# Altium schematic sheet STM32405RG.SchDoc: MCU STM
size A4; Author: Jennifer, Gaston, Alfonso; Organization: Waterloop; Address1: 200 University Ave W; Address2: Engineering 5, 1104; Address3: Waterloo, ON; Address4: N2L 3G1; DocumentNumber: 3; SheetNumber: 3; SheetTotal: 5
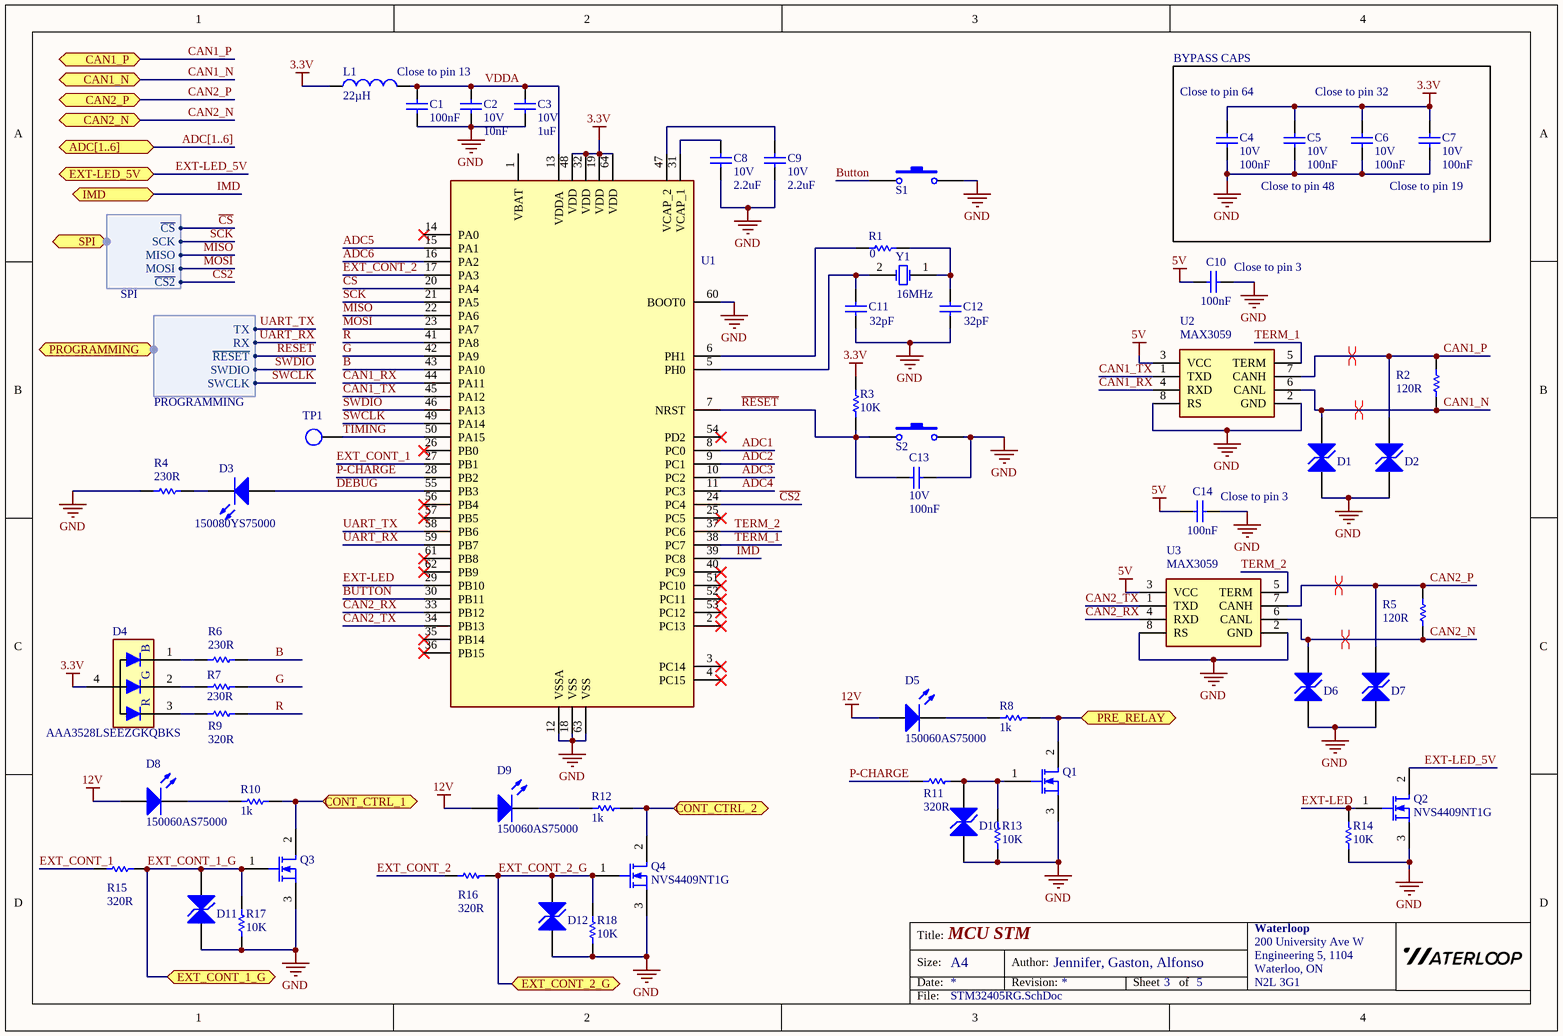
[diagram p0: STM32405RG.SchDoc]

## Parts
C1  value 100nF  [0805 - Capacitor]  (hidden comment: Capacitor - Nonpolarized)
C2  10V  value 10nF  [0805 - Capacitor]
C3  10V  value 1uF  [0805 - Capacitor]
C4  10V  value 100nF  [0805 - Capacitor]
C5  10V  value 100nF  [0805 - Capacitor]
C6  10V  value 100nF  [0805 - Capacitor]
C7  10V  value 100nF  [0805 - Capacitor]
C8  10V  value 2.2uF  [0805 - Capacitor]
C9  10V  value 2.2uF  [0805 - Capacitor]
C10  value 100nF  [0805 - Capacitor]  (hidden comment: 10V)
C11  value 32pF  [0805 - Capacitor]  (hidden comment: 50V)
C12  value 32pF  [0805 - Capacitor]  (hidden comment: 50V)
C13  10V  value 100nF  [0805 - Capacitor]
C14  value 100nF  [0805 - Capacitor]  (hidden comment: 10V)
D1  TVS  [SOD323 - DIODE]  (value not drawn)
D2  TVS  [SOD323 - DIODE]  (value not drawn)
D3  150080YS75000  [0805 - Resistor]
D4  AAA3528LSEEZGKQBKS  [4-PLCC RGB LED]
D5  150060AS75000  [0603 - Resistor]
D6  TVS  [SOD323 - DIODE]  (value not drawn)
D7  TVS  [SOD323 - DIODE]  (value not drawn)
D8  150060AS75000  [0603 - Resistor]
D9  150060AS75000  [0603 - Resistor]
D10  TVS  [SOD323 - DIODE]  (value not drawn)
D11  TVS  [SOD323 - DIODE]  (value not drawn)
D12  TVS  [SOD323 - DIODE]  (value not drawn)
L1  value 22µH  [0805 - Capacitor]  (hidden comment: Inductor)
Q1  NVS4409NT1G  [SC70/SOT323]  (value not drawn)
Q2  NVS4409NT1G  [SC70/SOT323]
Q3  NVS4409NT1G  [SC70/SOT323]  (value not drawn)
Q4  NVS4409NT1G  [SC70/SOT323]
R1  value 0  [0603 - Resistor]  (hidden comment: 0603)
R2  value 120R  [0603 - Resistor]  (hidden comment: 1%)
R3  value 10K  [0603 - Resistor]  (hidden comment: 5%)
R4  value 230R  [0603 - Resistor]  (hidden comment: 1%)
R5  value 120R  [0603 - Resistor]  (hidden comment: 1%)
R6  value 230R  [0603 - Resistor]  (hidden comment: 1%)
R7  value 230R  [0603 - Resistor]  (hidden comment: 1%)
R8  value 1k  [0603 - Resistor]  (hidden comment: 5%)
R9  value 320R  [0603 - Resistor]  (hidden comment: 1%)
R10  value 1k  [0603 - Resistor]  (hidden comment: 5%)
R11  value 320R  [0603 - Resistor]  (hidden comment: 1%)
R12  value 1k  [0603 - Resistor]  (hidden comment: 5%)
R13  value 10K  [0603 - Resistor]  (hidden comment: 5%)
R14  value 10K  [0603 - Resistor]  (hidden comment: 5%)
R15  value 320R  [0603 - Resistor]  (hidden comment: 1%)
R16  value 320R  [0603 - Resistor]  (hidden comment: 1%)
R17  value 10K  [0603 - Resistor]  (hidden comment: 5%)
R18  value 10K  [0603 - Resistor]  (hidden comment: 5%)
S1  PTS636 SM43 SMTR LFS  [6x6mm Switch]  (value not drawn)
S2  PTS636 SM43 SMTR LFS  [6x6mm Switch]  (value not drawn)
TP1  (no value)  [Test Point - 5002]  (no BOM)
U1  (no value)  [STM32F405RG]
U2  MAX3059  [MAX3059]
U3  MAX3059  [MAX3059]
Y1  value 16MHz  [2-SMD NO LEAD CRSYSTAL]  (hidden comment: ABM3-16.000MHZ-B2-T)

## Ports
ADC[1..6] (bidir), CAN1_N (bidir), CAN1_P (bidir), CAN2_N (bidir), CAN2_P (bidir), CONT_CTRL_1 (bidir), CONT_CTRL_2 (bidir), EXT-LED_5V (bidir), EXT_CONT_1_G (bidir), EXT_CONT_2_G (bidir), IMD (bidir), PRE_RELAY (bidir), PROGRAMMING (bidir, harness PROGRAMMING), SPI (bidir, harness SPI)

## Harnesses
SPI: ~{CS}, SCK, MISO, MOSI, ~{CS2}
PROGRAMMING: SWCLK, SWDIO, ~{RESET}, TX, RX

## Nets
3.3V: C4.1 C5.1 C6.1 C7.1 D4.4 L1.1 R3.2 U1.19(VDD) U1.32(VDD) U1.48(VDD) U1.64(VDD)
5V: C10.2 C14.2 U2.3(VCC) U3.3(VCC)
12V: D5.1(A) D8.1(A) D9.1(A)
GND: C1.1 C2.1 C3.2 C4.2 C5.2 C6.2 C7.2 C8.1 C9.1 C10.1 C11.1 C12.1 C13.2 C14.1 D1.1(A) D2.1(A) D6.1(A) D7.1(A) D10.1(A) D11.1(A) D12.1(A) Q1.3(S) Q2.3(S) Q3.3(S) Q4.3(S) R4.2 R13.1 R14.1 R17.1 R18.1 S1.2 S2.2 U1.12(VSSA) U1.18(VSS) U1.60(BOOT0) U1.63(VSS) U2.2(GND) U2.8(RS) U3.2(GND) U3.8(RS)
~{RESET}: C13.1 R3.1 S2.1 U1.7(NRST) ; port PROGRAMMING.~{RESET}
ADC1: U1.8(PC0)
ADC2: U1.9(PC1)
ADC3: U1.10(PC2)
ADC4: U1.11(PC3)
ADC5: U1.15(PA1)
ADC6: U1.16(PA2)
B: R6.1 U1.43(PA10)
Button: S1.1 U1.30(PB11)
~{CS}: U1.20(PA4) ; port SPI.~{CS}
~{CS2}: U1.24(PC4) ; port SPI.~{CS2}
CAN1_N: D1.2(K) R2.1 U2.6(CANL) ; port CAN1_N
CAN1_P: D2.2(K) R2.2 U2.7(CANH) ; port CAN1_P
CAN1_RX: U1.44(PA11) U2.4(RXD)
CAN1_TX: U1.45(PA12) U2.1(TXD)
CAN2_N: D6.2(K) R5.1 U3.6(CANL) ; port CAN2_N
CAN2_P: D7.2(K) R5.2 U3.7(CANH) ; port CAN2_P
CAN2_RX: U1.33(PB12) U3.4(RXD)
CAN2_TX: U1.34(PB13) U3.1(TXD)
CONT_CTRL_1: Q3.2(D) R10.1 ; port CONT_CTRL_1
CONT_CTRL_2: Q4.2(D) R12.1 ; port CONT_CTRL_2
DEBUG: D3.1(A) U1.55(PB3)
EXT-LED: Q2.1(G) R14.2 U1.29(PB10)
EXT-LED_5V: Q2.2(D) ; port EXT-LED_5V
EXT_CONT_1: R15.1 U1.27(PB1)
EXT_CONT_1_G: D11.2(K) Q3.1(G) R15.2 R17.2 ; port EXT_CONT_1_G
EXT_CONT_2: R16.1 U1.17(PA3)
EXT_CONT_2_G: D12.2(K) Q4.1(G) R16.2 R18.2 ; port EXT_CONT_2_G
G: R7.1 U1.42(PA9)
IMD: U1.39(PC8) ; port IMD
MISO: U1.22(PA6) ; port SPI.MISO
MOSI: U1.23(PA7) ; port SPI.MOSI
P-CHARGE: R11.2 U1.28(PB2)
PRE_RELAY: Q1.2(D) R8.1 ; port PRE_RELAY
R: R9.1 U1.41(PA8)
SCK: U1.21(PA5) ; port SPI.SCK
SWCLK: U1.49(PA14) ; port PROGRAMMING.SWCLK
SWDIO: U1.46(PA13) ; port PROGRAMMING.SWDIO
TERM_1: U1.38(PC7) U2.5(TERM)
TERM_2: U1.37(PC6) U3.5(TERM)
TIMING: TP1.1 U1.50(PA15)
UART_RX: U1.59(PB7) ; port PROGRAMMING.RX
UART_TX: U1.58(PB6) ; port PROGRAMMING.TX
VDDA: C1.2 C2.2 C3.1 L1.2 U1.13(VDDA)
NetC8_2: C8.2 U1.31(VCAP_1)
NetC9_2: C9.2 U1.47(VCAP_2)
NetC11_2: C11.2 U1.5(PH0) Y1.2(OSC2)
NetC12_2: C12.2 R1.2 Y1.1(OSC1)
NetD3_2: D3.2(K) R4.1
NetD4_1: D4.1 R6.2
NetD4_2: D4.2 R7.2
NetD4_3: D4.3 R9.2
NetD5_2: D5.2(K) R8.2
NetD8_2: D8.2(K) R10.2
NetD9_2: D9.2(K) R12.2
NetD10_2: D10.2(K) Q1.1(G) R11.1 R13.2
NetR1_1: R1.1 U1.6(PH1)

Not connected (* = marked no-connect by the designer): U1 1(VBAT) 2(PC13)* 3(PC14)* 4(PC15)* 14(PA0)* 25(PC5)* 26(PB0)* 35(PB14)* 36(PB15)* 40(PC9)* 51(PC10)* 52(PC11)* 53(PC12)* 54(PD2)* 56(PB4)* 57(PB5)* 61(PB8)* 62(PB9)*

## Buses and harness runs
bus ADC[1..6] = port ADC[1..6]

## Layout directives
differential pair: CAN1_N, CAN1_P, CAN2_N, CAN2_P

## Notes on the sheet
- (near L1) Close to pin 13
- BYPASS CAPS
- Close to pin 64
- Close to pin 32
- Close to pin 48
- Close to pin 19
- (near C10) Close to pin 3
- Close to pin 3
- Title:
- Size:
- Date:
- A4
- Author:
- Revision:
- Sheet
- of
- File:
- (in symbol RGB LED- Common Anode) B; G; R

## Library data of the parts
C1 C13 = Capacitor - Nonpolarized: C0805C104K8RACTU. 0.1µF ±10% 10V Ceramic Capacitor X7R 0805 (2012 Metric); Manufacturer: YAGEO; Manufacturer Part Number: CC0805KRX7R9BB104; Rating: 50V; Supplier Part Number: 311-1140-1-ND; Supplier: Digi-Key
C2 = Capacitor - Nonpolarized: C0805C103K8RAC7800. 10000pF ±10% 10V Ceramic Capacitor X7R 0805 (2012 Metric); Manufacturer: YAGEO; Manufacturer Part Number: CC0805MRX7R9BB103; Rating: 50V; Supplier Part Number: 311-4350-1-ND; Supplier: Digi-Key
C3 = Capacitor - Nonpolarized: CL21B105KPFNNNE. 1µF ±10% 10V Ceramic Capacitor X7R 0805 (2012 Metric); Manufacturer: YAGEO; Manufacturer Part Number: CC0805KKX5R8BB105; Rating: 25V; Supplier Part Number: 311-1868-1-ND; Supplier: Digikey
C4-C7 C10 C14 = Capacitor - Nonpolarized: C0805C104K8RAC7800. 0.1µF ±10% 10V Ceramic Capacitor X7R 0805 (2012 Metric); Manufacturer: YAGEO; Manufacturer Part Number: CC0805KRX7R9BB104; Rating: 50V; Supplier Part Number: 311-1140-1-ND; Supplier: Digi-Key
C8 C9 = Capacitor - Nonpolarized: CC0805KKX7R9BB225. 2.2µF ±10% 50V Ceramic Capacitor X7R 0805 (2012 Metric); Manufacturer: YAGEO; Manufacturer Part Number: CC0805KRX5R7BB225; Rating: 16V; Supplier Part Number: 311-3428-1-ND; Supplier: Digi-Key
C11 C12 = Capacitor - Nonpolarized: CBR08C409B5GAC. 4pF ±0.1pF 50V Ceramic Capacitor C0G, NP0 0805 (2012 Metric); Manufacturer: YAGEO; Manufacturer Part Number: CC0805JRNPO9BN330; Supplier Part Number: 311-1105-1-ND; Supplier: Digi-Key; Rating: 50V
D1 D2 D6 D7 D10-D12 = TVS: TVS Diode; Manufacturer Part Number: DESD5V0U1BA-7; Manufacturer: Diodes Incorporated; Supplier: Digikey; Supplier Part Number: DESD5V0U1BA-7DICT-ND; Value: *
D3 = LED: 150080YS75000, LED YELLOW CLEAR 0805 SMD; Manufacturer Part Number: 150080VS75000; Manufacturer: Würth Elektronik; Value: *; Supplier Part Number: 732-4986-1-ND; Rating: *; Supplier: Digi-Key
D4 = RGB LED- Common Anode: Red, Green, Blue (RGB) 621nm Red, 525nm Green, 465nm Blue LED Indication - Discrete 1.8V Red, 2.7V Green, 2.7V Blue 4-PLCC; Manufacturer: Kingbright; Manufacturer Part Number: AAA3528LSEEZGKQBKS; Supplier Part Number: 754-1967-1-ND; Supplier: Digi-Key
D5 D8 D9 = LED: Amber 605nm LED Indication - Discrete 2V 0603 (1608 Metric); Manufacturer: Würth Elektronik; Value: *; Manufacturer Part Number: 150060AS75000; Supplier Part Number: 732-150060AS75000CT-ND; Rating: *; Supplier: Digi-Key
L1 = Inductor: LBR2012T220K, 22 µH ±10% 100 mA 0805 (2012 Metric); Manufacturer: Taiyo Yuden; Rating: *; Manufacturer Part Number: LBR2012T220K; Supplier Part Number: 587-2046-2-ND; Supplier: Digi-Key
Q1-Q4 = MOSFET-N: N-Channel MOSFET; Manufacturer Part Number: PMF370XN,115; Manufacturer: Nexperia; Rating: 30V; Supplier: Digi-Key; Supplier Part Number: 1727-5422-1-ND; Value: *
R1 = Resistor: ERJ-U030R00V. 0 Ohms Jumper 0.1W, 1/10W Chip Resistor 0603 (1608 Metric) Anti-Sulfur, Automotive AEC-Q200 Thick Film; Manufacturer: Panasonic Electronic Components; Rating: *; Manufacturer Part Number: ERJ-U030R00V; Supplier Part Number: 10-ERJ-U030R00VCT-ND; Supplier: Digi-Key
R2 R5 = Resistor: RC0603FR-07120RL. 120 Ohms ±1% 0.1W, 1/10W Chip Resistor 0603 (1608 Metric) Moisture Resistant Thick Film; Manufacturer Part Number: RC0603FR-10120RL; Manufacturer: YAGEO; Rating: 0.1W; Supplier Part Number: 13-RC0603FR-10120RLCT-ND; Supplier: Digi-Key
R3 R13 R14 R17 R18 = Resistor: ERJ-3GEYJ103V. 10 kOhms ±5% 0.1W, 1/10W Chip Resistor 0603 (1608 Metric) Automotive AEC-Q200 Thick Film; Manufacturer Part Number: RC0603FR-0710KL; Manufacturer: YAGEO; Rating: 0.1W; Supplier Part Number: 311-10.0KHRCT-ND; Supplier: Digi-Key
R4 R6 R7 = Resistor: RC0603FR-07232RL, RES 232 OHM 1% 1/10W 0603; Manufacturer: YAGEO; Rating: 0.1W; Manufacturer Part Number: RC0603FR-07232RL; Supplier Part Number: 311-232HRCT-ND; Supplier: Digi-Key
R8 R10 R12 = Resistor: ERJ-PA3J202V. 2 kOhms ±5% 0.25W, 1/4W Chip Resistor 0603 (1608 Metric) Automotive AEC-Q200, Pulse Withstanding Thick Film; Manufacturer Part Number: RC0603JR-071KL; Manufacturer: YAGEO; Rating: 0.1W; Supplier Part Number: 311-1.0KGRCT-ND; Supplier: Digi-Key
R9 R11 = Resistor: RC0603FR-07324RL, RES 324 OHM 1% 1/10W 0603; Manufacturer Part Number: RC0603FR-07330RL; Manufacturer: YAGEO; Rating: 0.1W; Supplier Part Number: 311-330HRCT-ND; Supplier: Digi-Key
R15 R16 = Resistor: RC0603FR-07120RL. 120 Ohms ±1% 0.1W, 1/10W Chip Resistor 0603 (1608 Metric) Moisture Resistant Thick Film; Manufacturer Part Number: RC0603FR-07330RL; Manufacturer: YAGEO; Rating: 0.1W; Supplier Part Number: 311-330HRCT-ND; Supplier: Digi-Key
S1 S2 = Switch - Push Button: Tactile Switch SPST-NO Top Actuated Surface Mount; Manufacturer: C&K; Supplier: Digi-Key; Manufacturer Part Number: PTS636 SM43 SMTR LFS; Supplier Part Number: CKN12310-2-ND; Rating: *; Value: *
TP1 = Test Point
U1 = STM32F405RGT6: ST 64-pin Micro; Manufacturer Part Number: STM32F405RG; Manufacturer: ST; Supplier Part Number: 497-11767-ND; Supplier: Digikey; ComponentLink1Description: Datsheet; ComponentLink1URL: https://www.st.com/content/ccc/resource/technical/document/datasheet/ef/92/76/6d/bb/c2/4f/f7/DM00037051.pdf/files/DM00037051.pdf/jcr:content/translations/en.DM00037051.pdf
U2 U3 = MAX3059: IC TRANSCEIVER FULL 1/1 8SO; Manufacturer: Maxim; Manufacturer Part Number: MAX3059ASA+T; Supplier: Digikey; Supplier Part Number: MAX3059ASA+TCT-ND; ComponentLink1Description: Datasheet; ComponentLink1URL: https://datasheets.maximintegrated.com/en/ds/MAX3058-MAX3059.pdf
Y1 = Oscillator: 8MHz ±20ppm Crystal 12pF 300 Ohms 2-SMD, No Lead; Manufacturer Part Number: ABM3-16ECS-160-20-23A-EN-TR.000MHZ-B2-T; Manufacturer: ECS; Rating: 20pF; Supplier Part Number: XC982CT-ND; Supplier: Digi-Key